# Altium schematic sheet lcd.schdoc: LCD
size A4; Date: 10.25.2025; CheckedBy: BCY; DrawnBy: miaow; DocumentNumber: 6; Revision: v1.0.0; SheetNumber: 6; SheetTotal: 14; BoardType: MAIN_PCB; Desc: RGB LCD interface
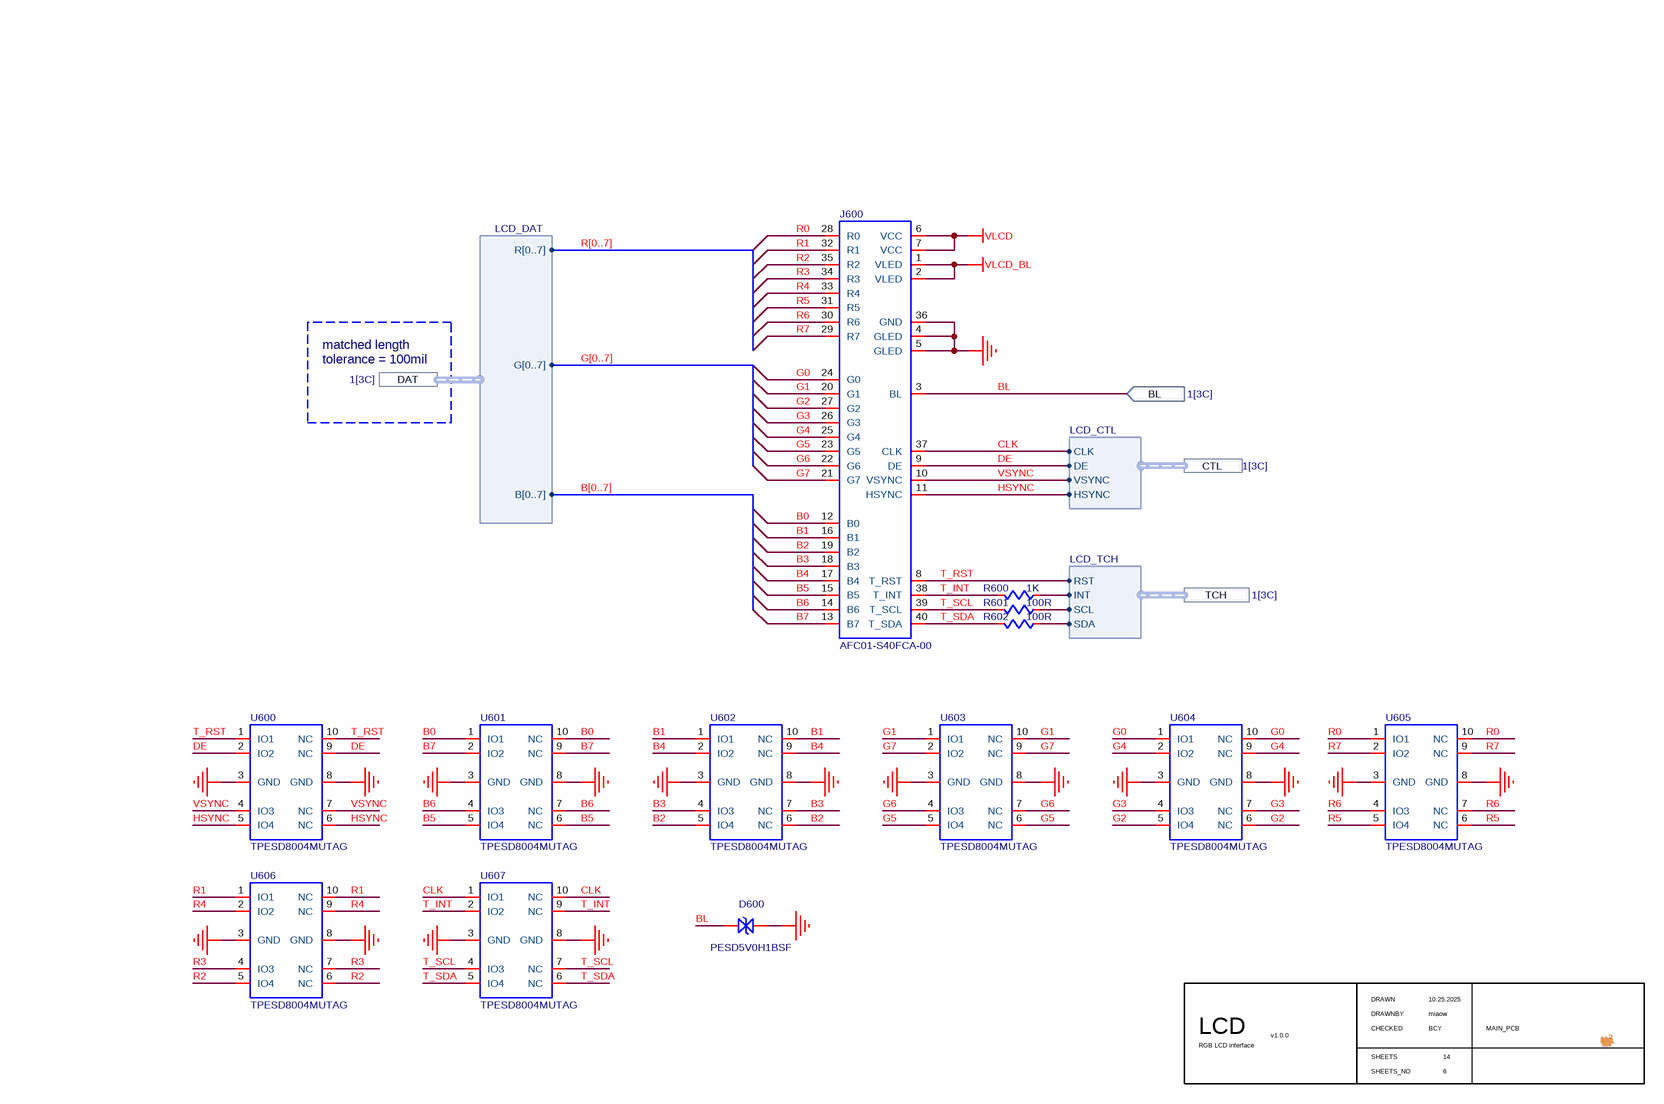
[diagram p0: lcd.schdoc]

## Parts
D600  PESD5V0H1BSF  [PESD5V0H1BSF]
J600  AFC01-S40FCA-00  [AFC01-S40FCA-00]
R600  value 1K  [R0402]  (hidden comment: R)
R601  value 100R  [R0402]  (hidden comment: R)
R602  value 100R  [R0402]  (hidden comment: R)
U600  TPESD8004MUTAG  [TPESD8004MUTAG]
U601  TPESD8004MUTAG  [TPESD8004MUTAG]
U602  TPESD8004MUTAG  [TPESD8004MUTAG]
U603  TPESD8004MUTAG  [TPESD8004MUTAG]
U604  TPESD8004MUTAG  [TPESD8004MUTAG]
U605  TPESD8004MUTAG  [TPESD8004MUTAG]
U606  TPESD8004MUTAG  [TPESD8004MUTAG]
U607  TPESD8004MUTAG  [TPESD8004MUTAG]

## Ports
BL (in, see 1[3C]), CTL (harness LCD_CTL, see 1[3C]), DAT (harness LCD_DAT, see 1[3C]), TCH (harness LCD_TCH, see 1[3C])

## Harnesses
LCD_DAT: R[0..7], G[0..7], B[0..7]
LCD_CTL: HSYNC, VSYNC, DE, CLK
LCD_TCH: SDA, SCL, INT, RST

## Nets
GND: D600.2 J600.4(GLED) J600.5(GLED) J600.36(GND) U600.3(GND) U600.8(GND) U601.3(GND) U601.8(GND) U602.3(GND) U602.8(GND) U603.3(GND) U603.8(GND) U604.3(GND) U604.8(GND) U605.3(GND) U605.8(GND) U606.3(GND) U606.8(GND) U607.3(GND) U607.8(GND)
VLCD: J600.6(VCC) J600.7(VCC)
VLCD_BL: J600.1(VLED) J600.2(VLED)
B0: J600.12(B0) U601.1(IO1) U601.10(NC)
B1: J600.16(B1) U602.1(IO1) U602.10(NC)
B2: J600.19(B2) U602.5(IO4) U602.6(NC)
B3: J600.18(B3) U602.4(IO3) U602.7(NC)
B4: J600.17(B4) U602.2(IO2) U602.9(NC)
B5: J600.15(B5) U601.5(IO4) U601.6(NC)
B6: J600.14(B6) U601.4(IO3) U601.7(NC)
B7: J600.13(B7) U601.2(IO2) U601.9(NC)
BL: D600.1 J600.3(BL) ; port BL
CLK: J600.37(CLK) U607.1(IO1) U607.10(NC) ; port CTL.CLK
DE: J600.9(DE) U600.2(IO2) U600.9(NC) ; port CTL.DE
G0: J600.24(G0) U604.1(IO1) U604.10(NC)
G1: J600.20(G1) U603.1(IO1) U603.10(NC)
G2: J600.27(G2) U604.5(IO4) U604.6(NC)
G3: J600.26(G3) U604.4(IO3) U604.7(NC)
G4: J600.25(G4) U604.2(IO2) U604.9(NC)
G5: J600.23(G5) U603.5(IO4) U603.6(NC)
G6: J600.22(G6) U603.4(IO3) U603.7(NC)
G7: J600.21(G7) U603.2(IO2) U603.9(NC)
HSYNC: J600.11(HSYNC) U600.5(IO4) U600.6(NC) ; port CTL.HSYNC
R0: J600.28(R0) U605.1(IO1) U605.10(NC)
R1: J600.32(R1) U606.1(IO1) U606.10(NC)
R2: J600.35(R2) U606.5(IO4) U606.6(NC)
R3: J600.34(R3) U606.4(IO3) U606.7(NC)
R4: J600.33(R4) U606.2(IO2) U606.9(NC)
R5: J600.31(R5) U605.5(IO4) U605.6(NC)
R6: J600.30(R6) U605.4(IO3) U605.7(NC)
R7: J600.29(R7) U605.2(IO2) U605.9(NC)
T_INT: J600.38(T_INT) R600.1 U607.2(IO2) U607.9(NC)
T_RST: J600.8(T_RST) U600.1(IO1) U600.10(NC) ; port TCH.RST
T_SCL: J600.39(T_SCL) R601.1 U607.4(IO3) U607.7(NC)
T_SDA: J600.40(T_SDA) R602.1 U607.5(IO4) U607.6(NC)
VSYNC: J600.10(VSYNC) U600.4(IO3) U600.7(NC) ; port CTL.VSYNC
NetR600_2: R600.2 ; port TCH.INT
NetR601_2: R601.2 ; port TCH.SCL
NetR602_2: R602.2 ; port TCH.SDA

## Buses and harness runs
bus B[0..7]
bus G[0..7]
bus R[0..7]

## Notes on the sheet
- matched length tolerance = 100mil
- DRAWN
- CHECKED
- DRAWNBY
- SHEETS
- SHEETS_NO

## Library data of the parts
D600 = PESD5V0H1BSF: TVS/ESD; Supplier 1: LCSC; Supplier Part Number 1: C477989
J600 = FPC-RGBLCD: Supplier 1: LCSC; Supplier Part Number 1: C262674
R600-R602 = R: precision: 1%
U600-U607 = TPESD8004MUTAG: TVS/ESD; Supplier 1: LCSC; Supplier Part Number 1: C2827679